# EAGLE schematic 20190105_ORIGAMI_V1-H (EAGLE 9.2.0)
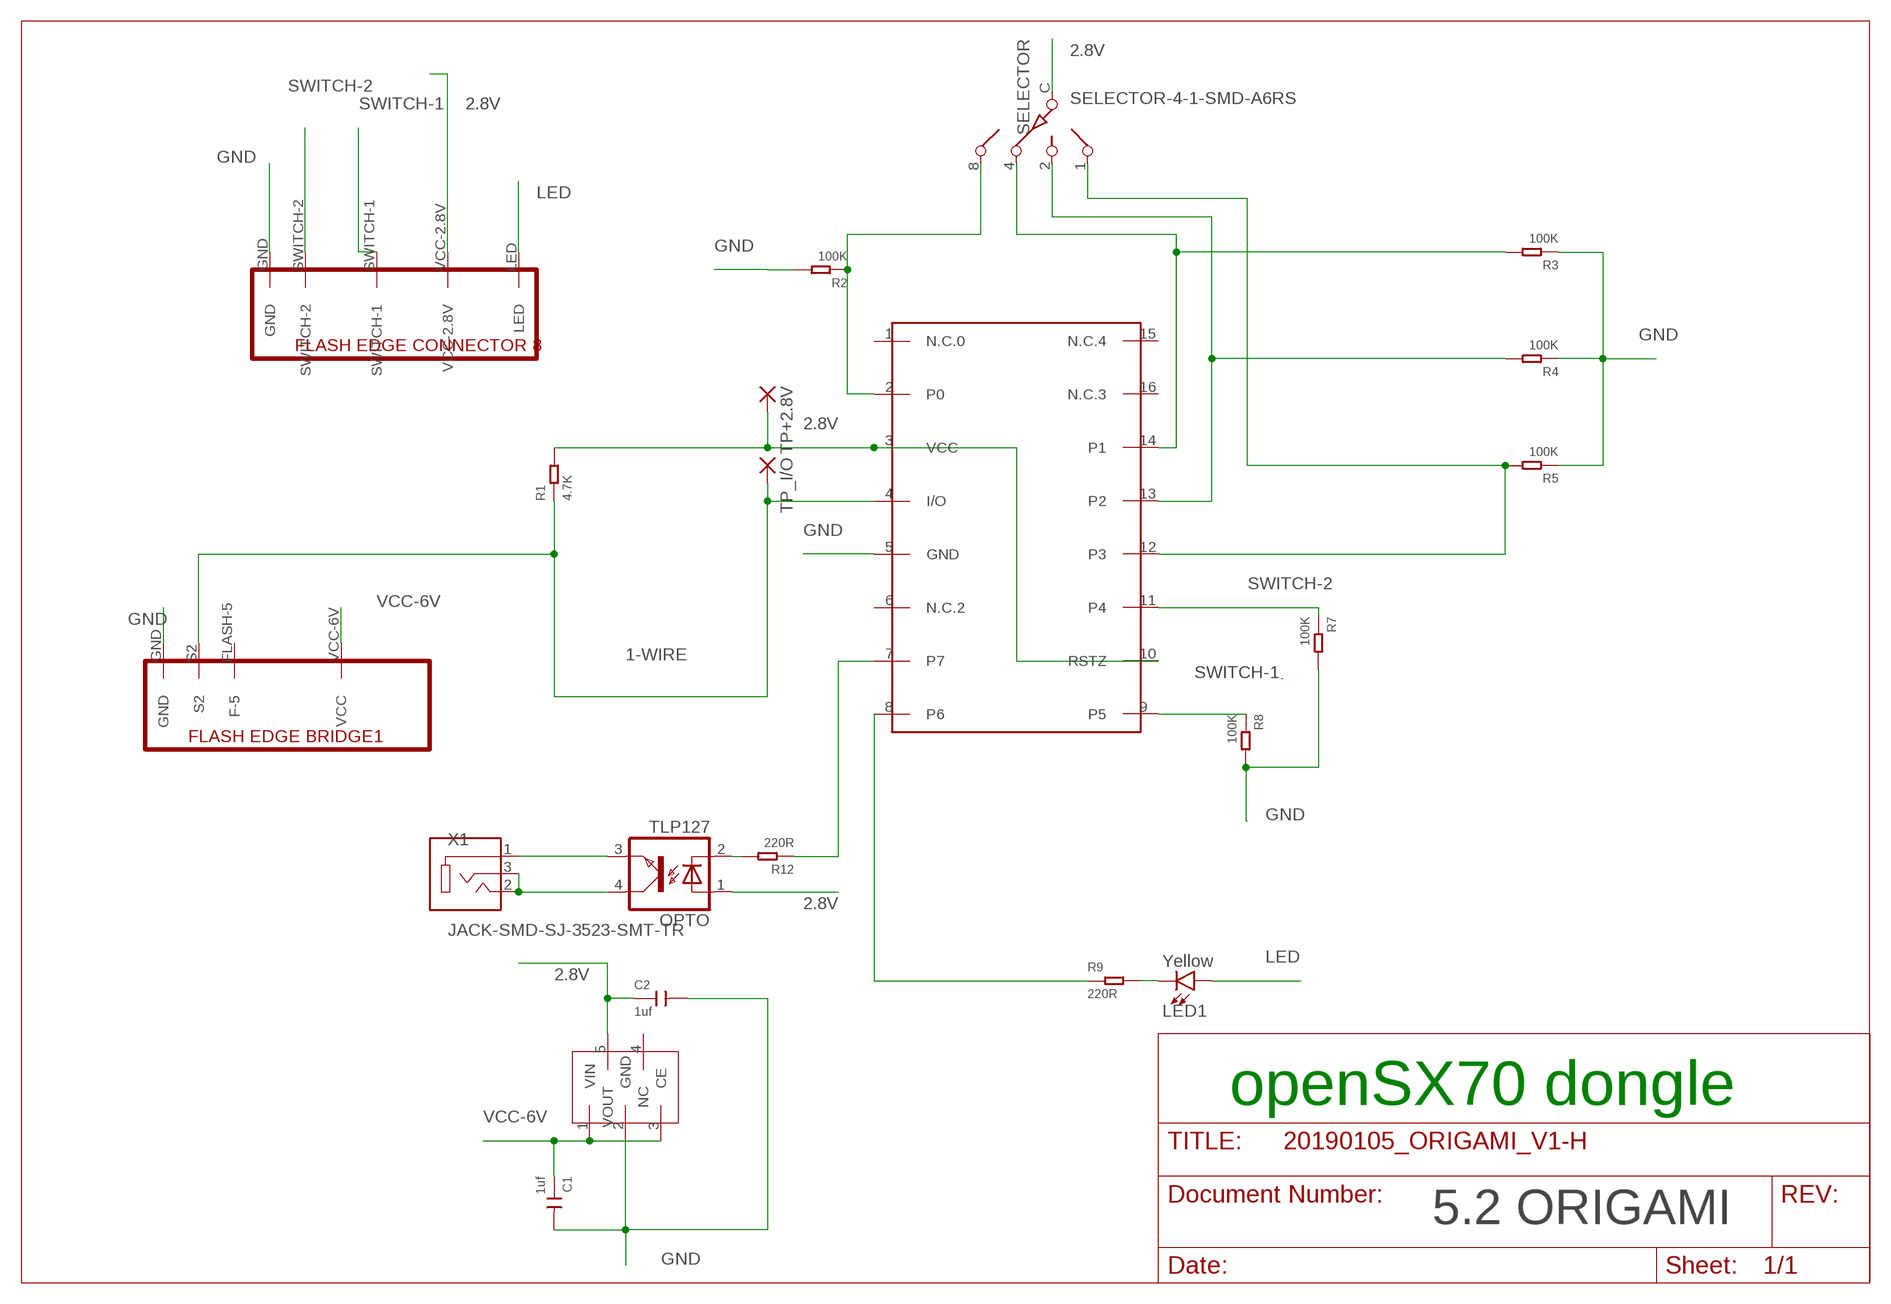
[diagram p0: schematic, sheet 1]

## Parts
C1  1uf  CERAMIC-1UF-25V-10%-X7R(0603)  [C0603]
C2  1uf  CERAMIC-1UF-25V-10%-X7R(0603)  [C0603]
DS2408  DS2408  [SO16]
LED1  Yellow  LED-YELLOWLILYPAD  [LED-1206]
OPTO  TLP127  [SO-4]
R1  4.7K  SMD-RES-4.7K-5%-1/10W(0603)  [R0603]
R2  100K  SMD-RES-100K-1%-1/10W(0603)  [R0603]
R3  100K  SMD-RES-100K-1%-1/10W(0603)  [R0603]
R4  100K  SMD-RES-100K-1%-1/10W(0603)  [R0603]
R5  100K  SMD-RES-100K-1%-1/10W(0603)  [R0603]
R7  100K  SMD-RES-100K-1%-1/10W(0603)  [R0603]
R8  100K  SMD-RES-100K-1%-1/10W(0603)  [R0603]
R9  220R  SMD-RES-220R-5%-1/10W(0603)  [R0603]
R12  220R  SMD-RES-220R-5%-1/10W(0603)  [R0603]
REG  NCP4688  [SOT-23-5]
SELECTOR  SELECTOR-4-1-SMD-A6RS  [A6RS-161RS]
TP+2.8V  SMD2  [SMD1,27-2,54]
TP_I/O  SMD2  [SMD1,27-2,54]
U$1  FLASH-BRIDGE-SW1-SW2-LED  [FLASH-8-BRIDGE-SW1-SW2-LED]
U$2  FLASH-BRIDGE1  [FLASH-8-BRIDGE1]
X1  JACK-SMD-SJ-3523-SMT-TR  [CUI_SJ-3523-SMT-TR]

## Nets
1-WIRE: DS2408.4(I/O) R1.1 TP_I/O.1(P) U$2.S2
2.8V: C2.1 DS2408.3(VCC) DS2408.10(RSTZ) OPTO.1(A) R1.2 REG.5(VOUT) SELECTOR.C TP+2.8V.1(P) U$1.VCC-2.8V
GND: C1.2 C2.2 DS2408.5(GND) R2.2 R3.1 R4.1 R5.1 R7.2 R8.2 REG.2(GND) U$1.GND U$2.GND
LED: LED1.A U$1.LED
N$1: OPTO.3(EMIT) X1.1
N$2: LED1.C R9.2
N$3: DS2408.2(P0) R2.1 SELECTOR.8
N$4: DS2408.14(P1) R3.2 SELECTOR.4
N$5: DS2408.13(P2) R4.2 SELECTOR.2
N$7: DS2408.8(P6) R9.1
N$9: OPTO.4(COL) X1.2 X1.3
N$10: OPTO.2(C) R12.2
N$11: DS2408.7 R12.1
N$13: DS2408.12(P3) R5.2 SELECTOR.1
SWITCH-1: DS2408.9(P5) R8.1 U$1.SWITCH-1
SWITCH-2: DS2408.11(P4) R7.1 U$1.SWITCH-2
VCC-6V: C1.1 REG.1(VIN) REG.3(CE) U$2.VCC-6V(VCC)
Unconnected: DS2408.1(N.C.0) DS2408.6(N.C.2) DS2408.15(N.C.4) DS2408.16(N.C.3) REG.4(NC) U$2.FLASH-5(F-5)

## Notes on the sheet
- openSX70 dongle
- 5.2 ORIGAMI

## Library data of the parts
C1 C2 = Seeed-Capacitor:CERAMIC-1UF-25V-10%-X7R(0603): 302010139; MPN: CC0603KRX7R8BB105
DS2408 = DS2408-joaco:DS2408
LED1 = SparkFun-LED:LED-YELLOW: Yellow SMD LED Used in manufacturing several products at SparkFun. Packages: 0603 - SMD 0603 package[Product Link] <http://www.kingbrightusa.com/product.asp?catalog_name=LED&product_id=APT1608SYCK> 0603 -SMART - SMART SMD 0603 package (more efficient/more expensive) [Product Link] <http://www.osram-os.com/osram_os/en/products/product-catalog/led-light-emitting-diodes/smartled-0603/ly-l29k/index.jsp> LilyPad - SMD1206 package[Product Datasheet] <https://www.sparkfun.com/datasheets/DevTools/LilyPad/Q150YUS4.pdf> SparkFun Products: Blynk Board <https://www.sparkfun.com/products/13794> IOIO-OTG <https://www.sparkfun.com/products/13613> XBee Explorer Serial <https://www.sparkfun.com/products/13225>; PROD_ID: DIO-09909
OPTO = openSX70:TLP127
R1 = Seeed-Resistor:SMD-RES-4.7K-5%-1/10W(0603): 301010290; MPN: RC0603JR-074K7L
R2-R5 R7 R8 = Seeed-Resistor:SMD-RES-100K-1%-1/10W(0603): 301010196; MPN: RC0603FR-07100KL
R9 R12 = Seeed-Resistor:SMD-RES-220R-5%-1/10W(0603): 301010163; MPN: RC0603JR-07220RL
REG = openSX70:NCP4688
SELECTOR = _openSX70:SELECTOR-4-1-SMD-A6RS
TP+2.8V TP_I/O = wirepad:SMD2: SMD PAD
U$1 = _openSX70:FLASH-BRIDGE-SW1-SW2-LED
U$2 = _openSX70:FLASH-BRIDGE1
X1 = _openSX70:JACK-SMD-SJ-3523-SMT-TR: Audio Jack Connector 3.5 mm Low Profile Surface Mount Stereo Jack, 3 Pin Right-Angle; AVAILABILITY: Unavailable; CUI_PURCHASE_URL: https://www.cui.com/product/interconnect/audio-connectors/3.5-mm-jacks/sj-352x-smt-series?utm_source=snapeda.com&utm_medium=referral&utm_campaign=snapedaBOM; DESCRIPTION: SJ Series 3.5 mm 12 V SMT Right Angle Stereo Audio Jack; MF: CUI Inc.; MP: SJ-3523-SMT-TR; PACKAGE: LGA-10 STMicroelectronics; PRICE: None

## Net classes
0 GND: width 0.305 mm
1 VCC: width 0.254 mm
2 2.8V: width 0.254 mm